# Altium schematic sheet SRAM_R1LV1616RSA.SchDoc
size A4
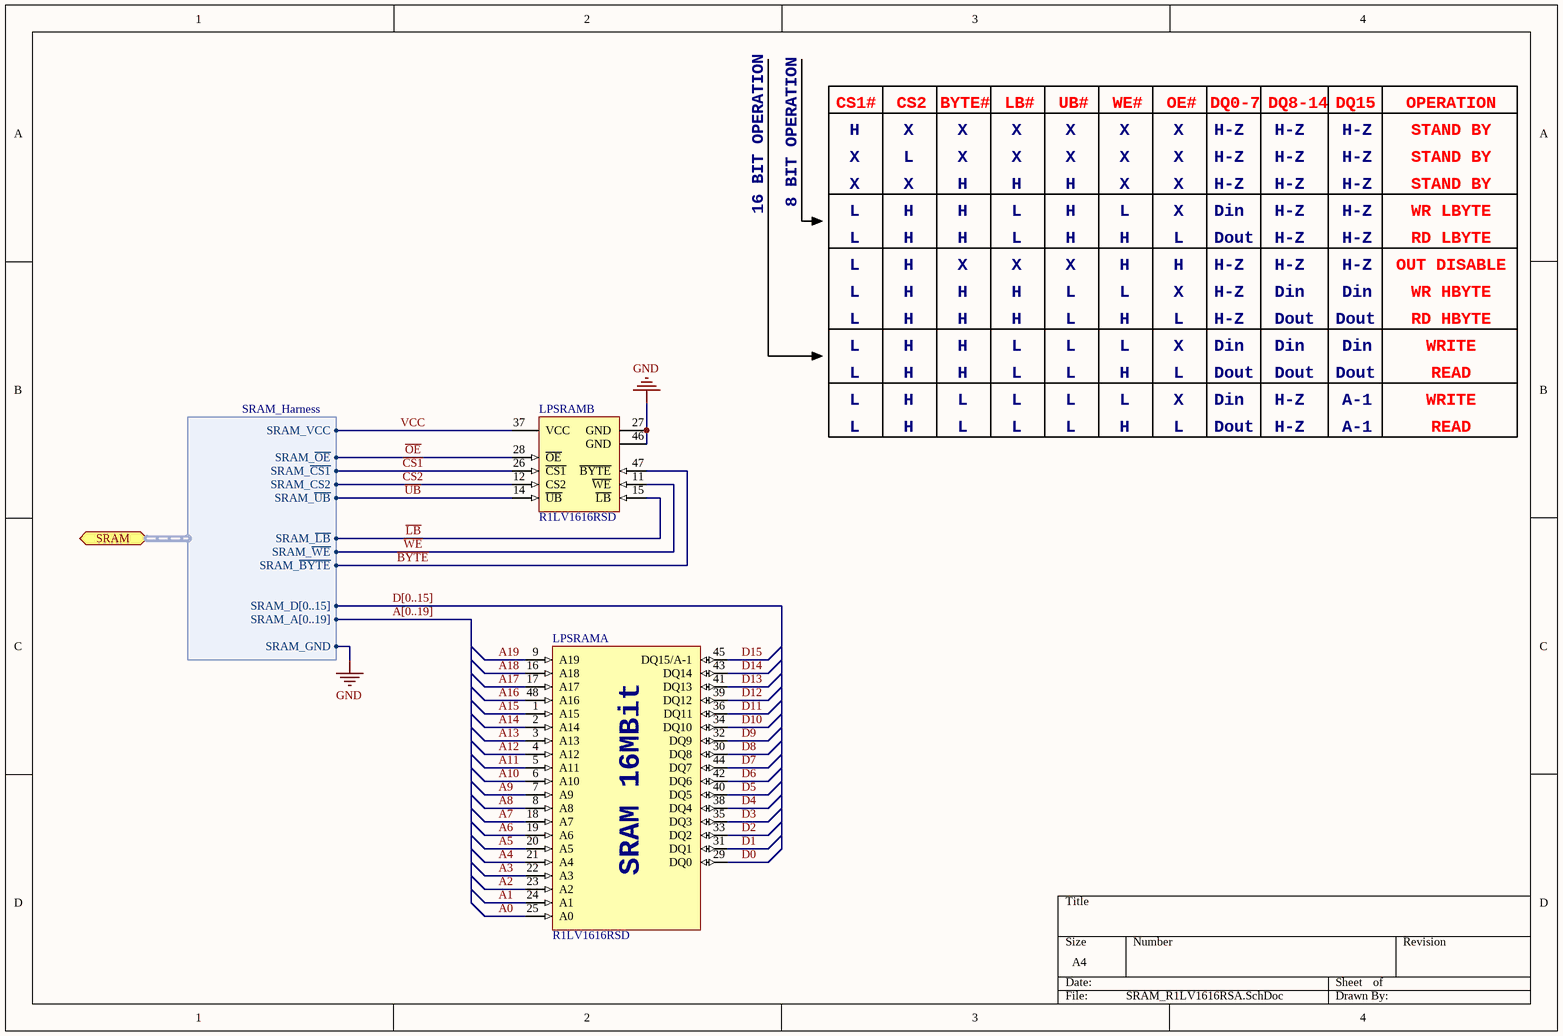
[diagram p0: SRAM_R1LV1616RSA.SchDoc]

## Parts
LPSRAM  R1LV1616RSD  [TSOP48]  (parts A,B of 2)

## Ports
SRAM (harness SRAM_Harness)

## Harnesses
SRAM_Harness: SRAM_A[0..19], SRAM_D[0..15], SRAM_~{UB}, SRAM_CS2, SRAM_~{CS1}, SRAM_~{OE}, SRAM_VCC, SRAM_~{LB}, SRAM_~{WE}, SRAM_~{BYTE}, SRAM_GND

## Nets
GND: LPSRAM.27(GND) LPSRAM.46(GND) ; port SRAM.SRAM_GND
A0: LPSRAM.25(A0)
A1: LPSRAM.24(A1)
A2: LPSRAM.23(A2)
A3: LPSRAM.22(A3)
A4: LPSRAM.21(A4)
A5: LPSRAM.20(A5)
A6: LPSRAM.19(A6)
A7: LPSRAM.18(A7)
A8: LPSRAM.8(A8)
A9: LPSRAM.7(A9)
A10: LPSRAM.6(A10)
A11: LPSRAM.5(A11)
A12: LPSRAM.4(A12)
A13: LPSRAM.3(A13)
A14: LPSRAM.2(A14)
A15: LPSRAM.1(A15)
A16: LPSRAM.48(A16)
A17: LPSRAM.17(A17)
A18: LPSRAM.16(A18)
A19: LPSRAM.9(A19)
~{BYTE}: LPSRAM.47(~{BYTE}) ; port SRAM.SRAM_~{BYTE}
~{CS1}: LPSRAM.26(~{CS1}) ; port SRAM.SRAM_~{CS1}
CS2: LPSRAM.12(CS2) ; port SRAM.SRAM_CS2
D0: LPSRAM.29(DQ0)
D1: LPSRAM.31(DQ1)
D2: LPSRAM.33(DQ2)
D3: LPSRAM.35(DQ3)
D4: LPSRAM.38(DQ4)
D5: LPSRAM.40(DQ5)
D6: LPSRAM.42(DQ6)
D7: LPSRAM.44(DQ7)
D8: LPSRAM.30(DQ8)
D9: LPSRAM.32(DQ9)
D10: LPSRAM.34(DQ10)
D11: LPSRAM.36(DQ11)
D12: LPSRAM.39(DQ12)
D13: LPSRAM.41(DQ13)
D14: LPSRAM.43(DQ14)
D15: LPSRAM.45(DQ15/A-1)
~{LB}: LPSRAM.15(~{LB}) ; port SRAM.SRAM_~{LB}
~{OE}: LPSRAM.28(~{OE}) ; port SRAM.SRAM_~{OE}
~{UB}: LPSRAM.14(~{UB}) ; port SRAM.SRAM_~{UB}
VCC: LPSRAM.37(VCC) ; port SRAM.SRAM_VCC
~{WE}: LPSRAM.11(~{WE}) ; port SRAM.SRAM_~{WE}

## Buses and harness runs
bus A[0..19]
bus D[0..15]

## Notes on the sheet
- CS1#
- CS2
- BYTE#
- LB#
- UB#
- WE#
- OE#
- DQ0-7
- DQ8-14
- DQ15
- OPERATION
- H
- X
- L
- H-Z
- STAND BY
- 16 BIT OPERATION
- 8 BIT OPERATION
- Din
- Dout
- WR LBYTE
- RD LBYTE
- OUT DISABLE
- WR HBYTE
- RD HBYTE
- WRITE
- READ
- A-1
- (in symbol R1LV1616RSD, part A) SRAM 16MBit

## Library data of the parts
LPSRAM = R1LV1616RSD: 16Mb Advanced LPSRAM; VCC: 2.7 V ~ 3.6 V; R1LV1616RSD-5S: 55ns; R1LV1616RSD-7S: 70ns; R1LV1616RSD-8S: 85ns; Digi-Key Part Number: R1LV1616RSA-5SI#B0-ND; Operating Temperature: -40°C ~ 85°C